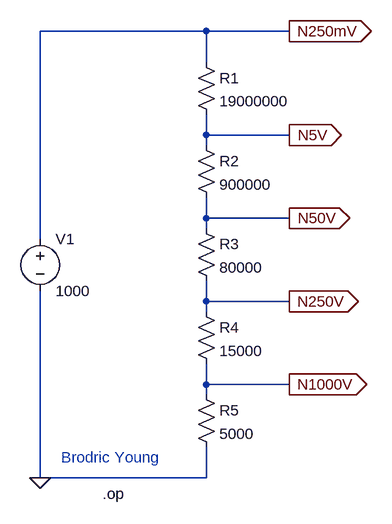
[diagram p0: schematic voltage_divider.asc]
voltage_divider.asc, the LTspice schematic file:
Version 4
SHEET 1 880 680
WIRE 384 -192 128 -192
WIRE 512 -192 384 -192
WIRE 384 -144 384 -192
WIRE 384 -32 384 -64
WIRE 512 -32 384 -32
WIRE 384 -16 384 -32
WIRE 384 96 384 64
WIRE 512 96 384 96
WIRE 384 112 384 96
WIRE 128 128 128 -192
WIRE 384 224 384 192
WIRE 512 224 384 224
WIRE 384 240 384 224
WIRE 384 352 384 320
WIRE 512 352 384 352
WIRE 384 368 384 352
WIRE 128 496 128 208
WIRE 384 496 384 448
WIRE 384 496 128 496
FLAG 128 496 0
FLAG 512 -192 N250mV
IOPIN 512 -192 Out
FLAG 512 -32 N5V
IOPIN 512 -32 Out
FLAG 512 96 N50V
IOPIN 512 96 Out
FLAG 512 224 N250V
IOPIN 512 224 Out
FLAG 512 352 N1000V
IOPIN 512 352 Out
SYMBOL voltage 128 112 R0
SYMATTR InstName V1
SYMATTR Value 1000
SYMBOL res 368 -160 R0
SYMATTR InstName R1
SYMATTR Value 19000000
SYMBOL res 368 -32 R0
SYMATTR InstName R2
SYMATTR Value 900000
SYMBOL res 368 96 R0
SYMATTR InstName R3
SYMATTR Value 80000
SYMBOL res 368 224 R0
SYMATTR InstName R4
SYMATTR Value 15000
SYMBOL res 368 352 R0
SYMATTR InstName R5
SYMATTR Value 5000
TEXT 160 464 Left 2 ;Brodric Young
TEXT 224 520 Left 2 !.op

The netlist it stands for:
* voltage_divider.asc
V1 N250mV 0 1000
R1 N250mV N5V 19000000
R2 N5V N50V 900000
R3 N50V N250V 80000
R4 N250V N1000V 15000
R5 N1000V 0 5000
* Brodric Young
.op
.backanno
.end